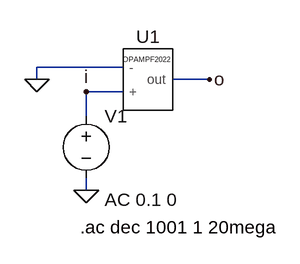
[diagram p0: schematic opamp_dynamicbehaviour.asc]
opamp_dynamicbehaviour.asc, the LTspice schematic file:
Version 4
SHEET 1 880 680
WIRE 144 112 32 112
WIRE 32 128 32 112
WIRE 256 128 208 128
WIRE 144 144 96 144
WIRE 96 176 96 144
WIRE 96 272 96 256
FLAG 96 272 0
FLAG 32 128 0
FLAG 256 128 o
FLAG 96 144 i
SYMBOL voltage 96 160 R0
WINDOW 123 24 124 Left 2
WINDOW 39 0 0 Left 0
SYMATTR Value2 AC 0.1 0
SYMATTR InstName V1
SYMATTR Value ""
SYMBOL OPAMPF2022 176 128 R0
SYMATTR InstName U1
TEXT 88 320 Left 2 !.ac dec 1001 1 20mega

The netlist it stands for:
* opamp_dynamicbehaviour.asc
V1 i 0 AC 0.1 0
XU1 i 0 o OPAMPF2022  ; pins + - out
.ac dec 1001 1 20mega
.lib C:\Users\ricig\Desktop\Lavoro\LTspice\schematics\FULL2024.cir
.backanno
.end